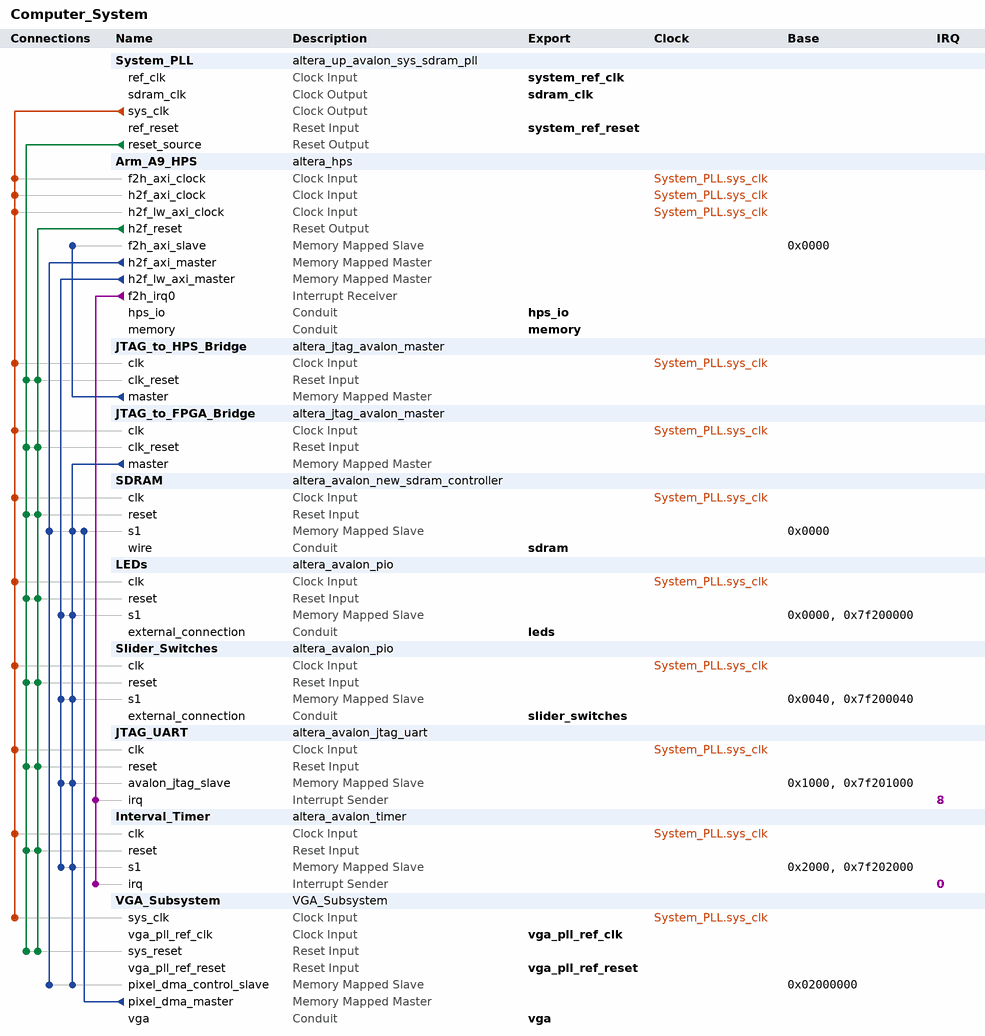
[diagram p0: system contents]
# Platform Designer (Qsys) system Computer_System, Cyclone V 5CSEMA5F31C6
# Parameters at their usual value, and those the tool derives, are not listed.
package require -exact qsys 14.0
create_system Computer_System
set_project_property DEVICE_FAMILY {Cyclone V}
set_project_property DEVICE 5CSEMA5F31C6

add_instance System_PLL altera_up_avalon_sys_sdram_pll 13.1
set_instance_parameter_value System_PLL gui_refclk 50.0
set_instance_parameter_value System_PLL gui_outclk 100.0
set_instance_parameter_value System_PLL CV_boards DE1-SoC

add_instance Arm_A9_HPS altera_hps 14.0
set_instance_parameter_value Arm_A9_HPS MEM_VENDOR JEDEC
set_instance_parameter_value Arm_A9_HPS MEM_ROW_ADDR_WIDTH 15
set_instance_parameter_value Arm_A9_HPS MEM_COL_ADDR_WIDTH 10
set_instance_parameter_value Arm_A9_HPS MEM_DQ_WIDTH 32
set_instance_parameter_value Arm_A9_HPS MEM_BANKADDR_WIDTH 3
set_instance_parameter_value Arm_A9_HPS MEM_DRV_STR RZQ/7
set_instance_parameter_value Arm_A9_HPS MEM_RTT_NOM RZQ/4
set_instance_parameter_value Arm_A9_HPS MEM_RTT_WR RZQ/4
set_instance_parameter_value Arm_A9_HPS MEM_WTCL 8
set_instance_parameter_value Arm_A9_HPS MEM_TCL 11
set_instance_parameter_value Arm_A9_HPS TIMING_TIS 180
set_instance_parameter_value Arm_A9_HPS TIMING_TIH 140
set_instance_parameter_value Arm_A9_HPS TIMING_TDS 30
set_instance_parameter_value Arm_A9_HPS TIMING_TDH 65
set_instance_parameter_value Arm_A9_HPS TIMING_TDQSQ 125
set_instance_parameter_value Arm_A9_HPS TIMING_TDQSCK 255
set_instance_parameter_value Arm_A9_HPS TIMING_TQSH 0.4
set_instance_parameter_value Arm_A9_HPS MEM_TRAS_NS 35.0
set_instance_parameter_value Arm_A9_HPS MEM_TRCD_NS 13.75
set_instance_parameter_value Arm_A9_HPS MEM_TRP_NS 13.75
set_instance_parameter_value Arm_A9_HPS MEM_TRFC_NS 260.0
set_instance_parameter_value Arm_A9_HPS MEM_TFAW_NS 30.0
set_instance_parameter_value Arm_A9_HPS REF_CLK_FREQ 25.0
set_instance_parameter_value Arm_A9_HPS TIMING_BOARD_MAX_CK_DELAY 0.03
set_instance_parameter_value Arm_A9_HPS TIMING_BOARD_MAX_DQS_DELAY 0.02
set_instance_parameter_value Arm_A9_HPS TIMING_BOARD_SKEW_CKDQS_DIMM_MIN 0.09
set_instance_parameter_value Arm_A9_HPS TIMING_BOARD_SKEW_CKDQS_DIMM_MAX 0.16
set_instance_parameter_value Arm_A9_HPS TIMING_BOARD_SKEW_WITHIN_DQS 0.01
set_instance_parameter_value Arm_A9_HPS TIMING_BOARD_SKEW_BETWEEN_DQS 0.08
set_instance_parameter_value Arm_A9_HPS TIMING_BOARD_DQ_TO_DQS_SKEW 0.0
set_instance_parameter_value Arm_A9_HPS TIMING_BOARD_AC_SKEW 0.03
set_instance_parameter_value Arm_A9_HPS TIMING_BOARD_AC_TO_CK_SKEW 0.0
set_instance_parameter_value Arm_A9_HPS MEM_CLK_FREQ 400.0
set_instance_parameter_value Arm_A9_HPS HPS_PROTOCOL DDR3
set_instance_parameter_value Arm_A9_HPS desired_cfg_clk_mhz 100.0
set_instance_parameter_value Arm_A9_HPS desired_qspi_clk_mhz 400.0
set_instance_parameter_value Arm_A9_HPS STM_Enable false
set_instance_parameter_value Arm_A9_HPS F2S_Width 2
set_instance_parameter_value Arm_A9_HPS S2F_Width 3
set_instance_parameter_value Arm_A9_HPS LWH2F_Enable true
set_instance_parameter_value Arm_A9_HPS F2SCLK_DBGRST_Enable false
set_instance_parameter_value Arm_A9_HPS F2SCLK_WARMRST_Enable false
set_instance_parameter_value Arm_A9_HPS F2SCLK_COLDRST_Enable false
set_instance_parameter_value Arm_A9_HPS F2SINTERRUPT_Enable true
set_instance_parameter_value Arm_A9_HPS EMAC1_PinMuxing {HPS I/O Set 0}
set_instance_parameter_value Arm_A9_HPS EMAC1_Mode RGMII
set_instance_parameter_value Arm_A9_HPS QSPI_PinMuxing {HPS I/O Set 0}
set_instance_parameter_value Arm_A9_HPS QSPI_Mode {1 SS}
set_instance_parameter_value Arm_A9_HPS SDIO_PinMuxing {HPS I/O Set 0}
set_instance_parameter_value Arm_A9_HPS SDIO_Mode {4-bit Data}
set_instance_parameter_value Arm_A9_HPS USB1_PinMuxing {HPS I/O Set 0}
set_instance_parameter_value Arm_A9_HPS USB1_Mode SDR
set_instance_parameter_value Arm_A9_HPS SPIM1_PinMuxing {HPS I/O Set 0}
set_instance_parameter_value Arm_A9_HPS SPIM1_Mode {Single Slave Select}
set_instance_parameter_value Arm_A9_HPS UART0_PinMuxing {HPS I/O Set 0}
set_instance_parameter_value Arm_A9_HPS UART0_Mode {No Flow Control}
set_instance_parameter_value Arm_A9_HPS I2C0_PinMuxing {HPS I/O Set 0}
set_instance_parameter_value Arm_A9_HPS I2C0_Mode I2C
set_instance_parameter_value Arm_A9_HPS I2C1_PinMuxing {HPS I/O Set 0}
set_instance_parameter_value Arm_A9_HPS I2C1_Mode I2C
set_instance_parameter_value Arm_A9_HPS FPGA_PERIPHERAL_OUTPUT_CLOCK_FREQ_EMAC0_MD_CLK 100
set_instance_parameter_value Arm_A9_HPS FPGA_PERIPHERAL_OUTPUT_CLOCK_FREQ_EMAC0_GTX_CLK 100
set_instance_parameter_value Arm_A9_HPS FPGA_PERIPHERAL_OUTPUT_CLOCK_FREQ_EMAC1_MD_CLK 100
set_instance_parameter_value Arm_A9_HPS FPGA_PERIPHERAL_OUTPUT_CLOCK_FREQ_EMAC1_GTX_CLK 100

add_instance JTAG_to_HPS_Bridge altera_jtag_avalon_master 14.0

add_instance JTAG_to_FPGA_Bridge altera_jtag_avalon_master 14.0

add_instance SDRAM altera_avalon_new_sdram_controller 14.0
set_instance_parameter_value SDRAM TAC 5.5
set_instance_parameter_value SDRAM TRCD 20.0
set_instance_parameter_value SDRAM TRP 20.0
set_instance_parameter_value SDRAM casLatency 3
set_instance_parameter_value SDRAM columnWidth 10
set_instance_parameter_value SDRAM dataWidth 16
set_instance_parameter_value SDRAM generateSimulationModel true
set_instance_parameter_value SDRAM model single_Micron_MT48LC4M32B2_7_chip
set_instance_parameter_value SDRAM numberOfBanks 4
set_instance_parameter_value SDRAM numberOfChipSelects 1
set_instance_parameter_value SDRAM powerUpDelay 100.0
set_instance_parameter_value SDRAM refreshPeriod 15.625
set_instance_parameter_value SDRAM rowWidth 12

add_instance LEDs altera_avalon_pio 14.0
set_instance_parameter_value LEDs direction Output
set_instance_parameter_value LEDs width 10

add_instance Slider_Switches altera_avalon_pio 14.0
set_instance_parameter_value Slider_Switches direction Input
set_instance_parameter_value Slider_Switches simDoTestBenchWiring true
set_instance_parameter_value Slider_Switches width 10

add_instance JTAG_UART altera_avalon_jtag_uart 14.0
set_instance_parameter_value JTAG_UART simInteractiveOptions NO_INTERACTIVE_WINDOWS

add_instance Interval_Timer altera_avalon_timer 14.0
set_instance_parameter_value Interval_Timer period 125.0
set_instance_parameter_value Interval_Timer periodUnits MSEC

add_instance VGA_Subsystem VGA_Subsystem 1.0

# connections
add_connection System_PLL.sys_clk Arm_A9_HPS.f2h_axi_clock clock
add_connection System_PLL.sys_clk Arm_A9_HPS.h2f_axi_clock clock
add_connection System_PLL.sys_clk Arm_A9_HPS.h2f_lw_axi_clock clock
add_connection System_PLL.sys_clk Interval_Timer.clk clock
add_connection System_PLL.sys_clk JTAG_to_FPGA_Bridge.clk clock
add_connection System_PLL.sys_clk JTAG_to_HPS_Bridge.clk clock
add_connection System_PLL.sys_clk JTAG_UART.clk clock
add_connection System_PLL.sys_clk LEDs.clk clock
add_connection System_PLL.sys_clk SDRAM.clk clock
add_connection System_PLL.sys_clk Slider_Switches.clk clock
add_connection System_PLL.sys_clk VGA_Subsystem.sys_clk clock
add_connection Arm_A9_HPS.h2f_reset Interval_Timer.reset reset
add_connection Arm_A9_HPS.h2f_reset JTAG_to_FPGA_Bridge.clk_reset reset
add_connection Arm_A9_HPS.h2f_reset JTAG_to_HPS_Bridge.clk_reset reset
add_connection Arm_A9_HPS.h2f_reset JTAG_UART.reset reset
add_connection Arm_A9_HPS.h2f_reset LEDs.reset reset
add_connection Arm_A9_HPS.h2f_reset SDRAM.reset reset
add_connection Arm_A9_HPS.h2f_reset Slider_Switches.reset reset
add_connection Arm_A9_HPS.h2f_reset VGA_Subsystem.sys_reset reset
add_connection System_PLL.reset_source Interval_Timer.reset reset
add_connection System_PLL.reset_source JTAG_to_FPGA_Bridge.clk_reset reset
add_connection System_PLL.reset_source JTAG_to_HPS_Bridge.clk_reset reset
add_connection System_PLL.reset_source JTAG_UART.reset reset
add_connection System_PLL.reset_source LEDs.reset reset
add_connection System_PLL.reset_source SDRAM.reset reset
add_connection System_PLL.reset_source Slider_Switches.reset reset
add_connection System_PLL.reset_source VGA_Subsystem.sys_reset reset
add_connection Arm_A9_HPS.h2f_axi_master SDRAM.s1 avalon
set_connection_parameter_value Arm_A9_HPS.h2f_axi_master/SDRAM.s1 baseAddress 0x0000
add_connection Arm_A9_HPS.h2f_axi_master VGA_Subsystem.pixel_dma_control_slave avalon
set_connection_parameter_value Arm_A9_HPS.h2f_axi_master/VGA_Subsystem.pixel_dma_control_slave baseAddress 0x02000000
add_connection Arm_A9_HPS.h2f_lw_axi_master Interval_Timer.s1 avalon
set_connection_parameter_value Arm_A9_HPS.h2f_lw_axi_master/Interval_Timer.s1 baseAddress 0x2000
add_connection Arm_A9_HPS.h2f_lw_axi_master JTAG_UART.avalon_jtag_slave avalon
set_connection_parameter_value Arm_A9_HPS.h2f_lw_axi_master/JTAG_UART.avalon_jtag_slave baseAddress 0x1000
add_connection Arm_A9_HPS.h2f_lw_axi_master LEDs.s1 avalon
set_connection_parameter_value Arm_A9_HPS.h2f_lw_axi_master/LEDs.s1 baseAddress 0x0000
add_connection Arm_A9_HPS.h2f_lw_axi_master Slider_Switches.s1 avalon
set_connection_parameter_value Arm_A9_HPS.h2f_lw_axi_master/Slider_Switches.s1 baseAddress 0x0040
add_connection JTAG_to_FPGA_Bridge.master Interval_Timer.s1 avalon
set_connection_parameter_value JTAG_to_FPGA_Bridge.master/Interval_Timer.s1 baseAddress 0x7f202000
add_connection JTAG_to_FPGA_Bridge.master JTAG_UART.avalon_jtag_slave avalon
set_connection_parameter_value JTAG_to_FPGA_Bridge.master/JTAG_UART.avalon_jtag_slave baseAddress 0x7f201000
add_connection JTAG_to_FPGA_Bridge.master LEDs.s1 avalon
set_connection_parameter_value JTAG_to_FPGA_Bridge.master/LEDs.s1 baseAddress 0x7f200000
add_connection JTAG_to_FPGA_Bridge.master SDRAM.s1 avalon
set_connection_parameter_value JTAG_to_FPGA_Bridge.master/SDRAM.s1 baseAddress 0x0000
add_connection JTAG_to_FPGA_Bridge.master Slider_Switches.s1 avalon
set_connection_parameter_value JTAG_to_FPGA_Bridge.master/Slider_Switches.s1 baseAddress 0x7f200040
add_connection JTAG_to_FPGA_Bridge.master VGA_Subsystem.pixel_dma_control_slave avalon
set_connection_parameter_value JTAG_to_FPGA_Bridge.master/VGA_Subsystem.pixel_dma_control_slave baseAddress 0x02000000
add_connection JTAG_to_HPS_Bridge.master Arm_A9_HPS.f2h_axi_slave avalon
set_connection_parameter_value JTAG_to_HPS_Bridge.master/Arm_A9_HPS.f2h_axi_slave baseAddress 0x0000
add_connection VGA_Subsystem.pixel_dma_master SDRAM.s1 avalon
set_connection_parameter_value VGA_Subsystem.pixel_dma_master/SDRAM.s1 baseAddress 0x0000
add_connection Arm_A9_HPS.f2h_irq0 Interval_Timer.irq interrupt
set_connection_parameter_value Arm_A9_HPS.f2h_irq0/Interval_Timer.irq irqNumber 0
add_connection Arm_A9_HPS.f2h_irq0 JTAG_UART.irq interrupt
set_connection_parameter_value Arm_A9_HPS.f2h_irq0/JTAG_UART.irq irqNumber 8

# exported interfaces
add_interface system_ref_clk clock sink
set_interface_property system_ref_clk EXPORT_OF System_PLL.ref_clk
add_interface system_ref_reset reset sink
set_interface_property system_ref_reset EXPORT_OF System_PLL.ref_reset
add_interface sdram_clk clock source
set_interface_property sdram_clk EXPORT_OF System_PLL.sdram_clk
add_interface memory conduit end
set_interface_property memory EXPORT_OF Arm_A9_HPS.memory
add_interface hps_io conduit end
set_interface_property hps_io EXPORT_OF Arm_A9_HPS.hps_io
add_interface sdram conduit end
set_interface_property sdram EXPORT_OF SDRAM.wire
add_interface vga_pll_ref_clk clock sink
set_interface_property vga_pll_ref_clk EXPORT_OF VGA_Subsystem.vga_pll_ref_clk
add_interface vga conduit end
set_interface_property vga EXPORT_OF VGA_Subsystem.vga
add_interface vga_pll_ref_reset reset sink
set_interface_property vga_pll_ref_reset EXPORT_OF VGA_Subsystem.vga_pll_ref_reset
add_interface slider_switches conduit end
set_interface_property slider_switches EXPORT_OF Slider_Switches.external_connection
add_interface leds conduit end
set_interface_property leds EXPORT_OF LEDs.external_connection

set_interconnect_requirement {$system} qsys_mm.clockCrossingAdapter HANDSHAKE
set_interconnect_requirement {$system} qsys_mm.maxAdditionalLatency 1
set_interconnect_requirement {$system} qsys_mm.insertDefaultSlave false

save_system Computer_System.qsys
